# Altium project AC Circuit.PrjPcb
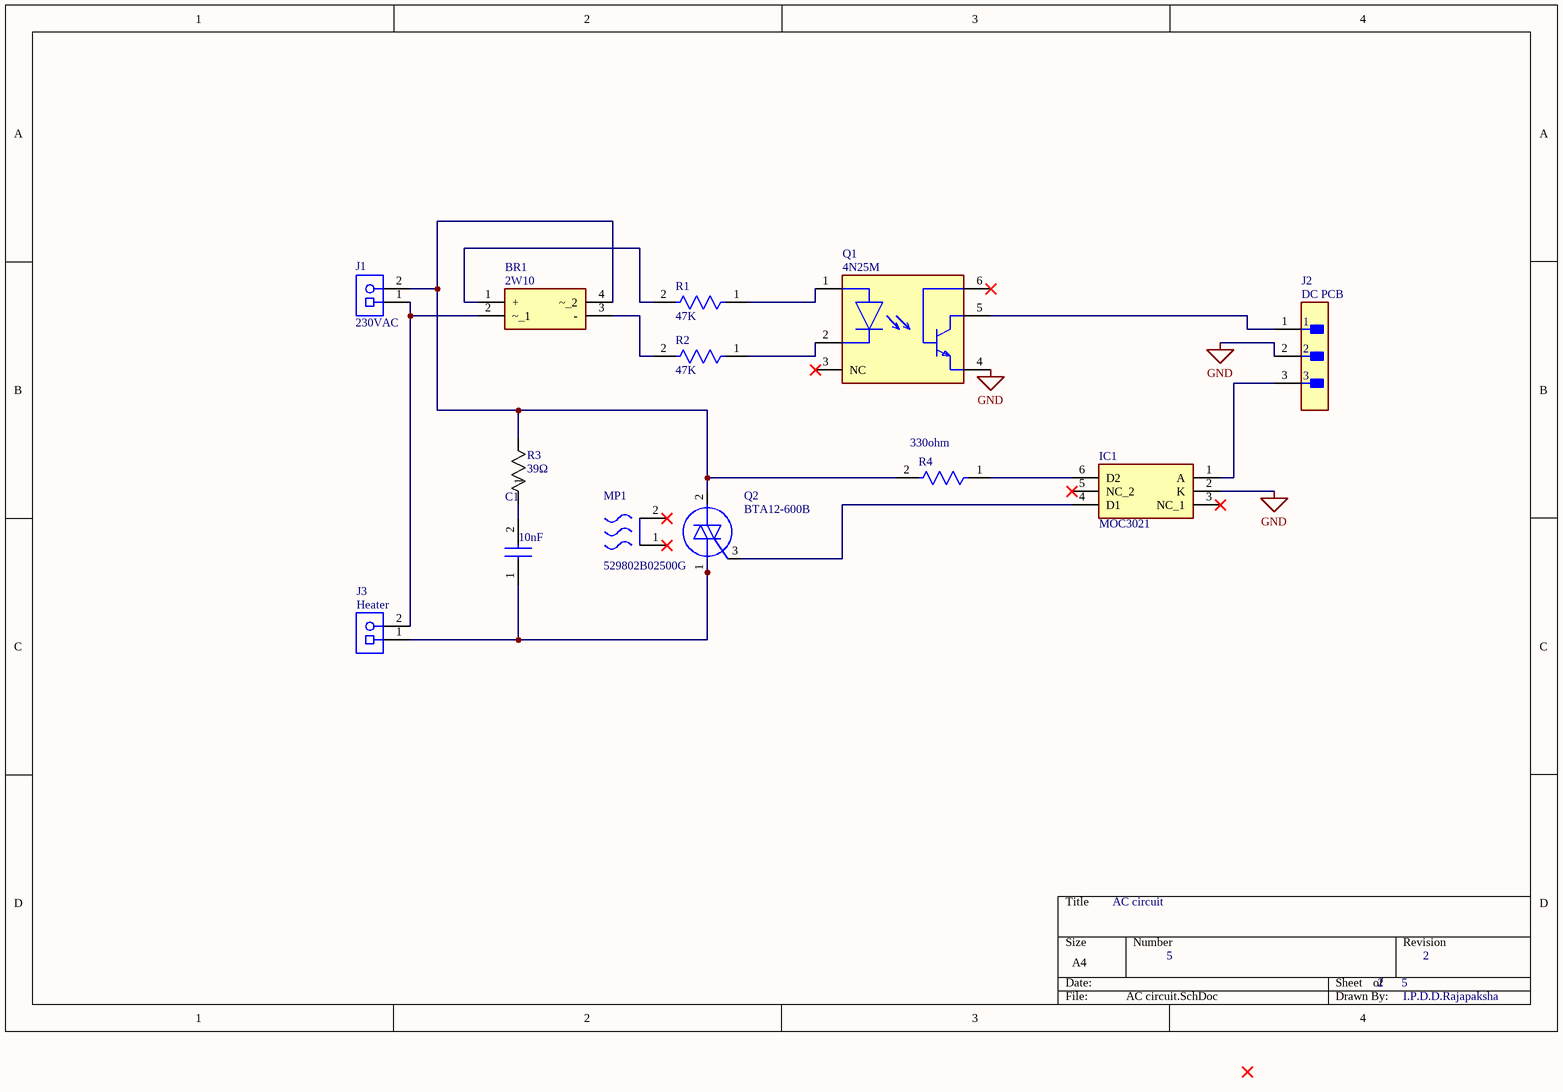
[diagram p0: AC circuit.SchDoc]
1 sheet, 13 parts. Net scope: global (net labels, ports and power ports of the same name join across sheets).
Board file: AC.PcbDoc

## Sheet AC circuit.SchDoc
size A4; SheetNumber: 1; SheetTotal: 1

### Parts
BR1  2W10  [2W10]
C1  Parameter 1: 10nF  [DE2E3SA103MA3BY02F]  (hidden comment: DE2E3SA103MA3BY02F)
IC1  MOC3021  [DIP762W50P254L712H450Q6N]
J1  Parameter 1: 230VAC  [PHOE-1729128-2_V]  (hidden comment: 1729128)
J2  Parameter 1: DC PCB  [FP-B3B-XH-AM_LF_SN-MFG]  (hidden comment: B3B-XH-AM(LF)(SN))
J3  Parameter 1: Heater  [PHOE-1729128-2_V]  (hidden comment: 1729128)
MP1  529802B02500G  [FP-529802B02500G-MFG]
Q1  4N25M  [FP-646BX-MFG]
Q2  BTA12-600B  [TO255P460X1020X1965-3P]
R1  value 47K  [FP-CMF50-0]  (hidden comment: CMF5073K200FHEB)
R2  value 47K  [FP-CMF50-0]  (hidden comment: CMF5073K200FHEB)
R3  Resistance: 39Ω  [RES_AC03_VIS]  (hidden comment: AC03000003909JAC00)
R4  value 330ohm  [FP-CMF50-0]  (hidden comment: CMF5073K200FHEB)

### Nets
GND: IC1.2(K) J2.2 Q1.4(E)
NetBR1_1: BR1.1(+) R1.2
NetBR1_2: BR1.2(~_1) J1.1 J3.2
NetBR1_3: BR1.3(-) R2.2
NetBR1_4: BR1.4(~_2) J1.2 Q2.2(MT2) R3.2 R4.2
NetC1_1: C1.1 J3.1 Q2.1(MT1)
NetC1_2: C1.2 R3.1
NetIC1_1: IC1.1(A) J2.3
NetIC1_4: IC1.4(D1) Q2.3(G)
NetIC1_6: IC1.6(D2) R4.1
NetJ2_1: J2.1 Q1.5(C)
NetQ1_1: Q1.1(A) R1.1
NetQ1_2: Q1.2(C) R2.1

Not connected (* = marked no-connect by the designer): IC1 3(NC_1)* 5(NC_2)*; MP1 1(MNT_1)* 2(MNT_2)*; Q1 3(NC)* 6(B)*

### Notes on the sheet
- AC circuit
- 5
- 2      5
- 2
- I.P.D.D.Rajapaksha

### Library data of the parts
BR1 = 2W10: Bridge Rectifier; Manufacturer_Name: Good-Ark; Datasheet Link: https://goodarksemi.com/docs/datasheets/general_purpose_bridge_rectifiers/2Wxx.pdf; Manufacturer_Part_Number: 2W10; Arrow Part Number: 2W10; Arrow Price/Stock: https://www.arrow.com/en/products/2w10/good-ark-semiconductor?region=nac
C1 = DE2E3SA103MA3BY02F: Capacitor; Manufacturer_Name: Murata Electronics; Datasheet Link: https://psearch.en.murata.com/capacitor/product/DE2E3SA103MA3BY02F.html; Height: 20mm; Manufacturer_Part_Number: DE2E3SA103MA3BY02F; Mouser Part Number: 81-DE2E3SA103MA3BY2F; Mouser Price/Stock: https://www.mouser.co.uk/ProductDetail/Murata-Electronics/DE2E3SA103MA3BY02F?qs=rrS6PyfT74eTx4TUt%2F2ksQ%3D%3D; Arrow Part Number: DE2E3SA103MA3BY02F; Arrow Price/Stock: https://www.arrow.com/en/products/de2e3sa103ma3by02f/murata-manufacturing
IC1 = MOC3021: Integrated Circuit; Manufacturer_Name: Isocom; Datasheet Link: https://www.arrow.com/en/products/moc3021/isocom; Height: 4.5mm; Manufacturer_Part_Number: MOC3021; Arrow Part Number: MOC3021; Arrow Price/Stock: https://www.arrow.com/en/products/moc3021/isocom?region=nac
J1 J3 = CMP-2000-05815-1: PCB Terminal Block, 13.5 A, 400 V, 2-Pin THD, RoHS, Bulk; Manufacturer: Phoenix Contact; Package Version: 03/2015; No. of Rows: 1; Pitch: 5.08mm; No. of Positions: 2; Voltage Rating: 400V; Current Rating: 13500mA; Manufacturer URL: http://www.phoenixcontact.com/; Datasheet URL: https://datasheet.ciiva.com/16046/1729128-16046181.pdf; RoHS: TRUE; Package URL: https://www.phoenixcontact.com/online/portal/pi/pxc/product_detail_page/!ut/p/b1/3VdJjqNKFDxLH8AFycySyWY2ozFsEPOMMQaDOX1XedGL_1Vdm5YXJleknhSKeBkvI6EA8ncAo3AYoDhBQGco6KN7VURTdemj9us_IEKEZo_YHiPAEWEFmDGOHMORkqKYCORBZxgL7ZoaZYcbFFUZ3fqxSY6GOuxydWUuHqz1ynmMFygu583Bob0Ewr6Sd_l-5m-kAueHiB0jpRwZwe58wwtkpxtMYd_LmGcDRU02dRNEyWt6Y2ti5pSyJ_reIkzIulrqApdnbT11V5jnCKbYNCvhEM1MCpPByat_X379-iThf08CI5GfOPqfBeS3BRoBOdD55AKVv0iLwCMq-2BrzXWSGRH7pUGD9uwXQjiph3xL0DKQwdGa0JImiIOmBNOestqgwTHSSs2oOep-78apyXQBvNi8ZLaFjvjWvcaUEBu0MC6Wbe-d6mB0FAebo2lUWinqYaZs5DAYzV0RP9yitUjnGJ0iI9xhZkT42OCQNUJJhkgWINNQLP2JFP6OpMg3JCVg70jqHT0lvKOnhHf0lPuOnnLf0VPuWx6_dxwUIvwk5WMkT0kLL1mh61l2yZVSzG3pYV_bqo-mj6uMKwKwdnnW8Jh5RTOJzMOA5c-eJDaZQw4mTMPH02PvS_ZAqNVjVTo2WyYLkwH_KU1mmmG5kjRhDqPXLwwVHvVOjCM60-fpXvTDfMGW1PVFVS1r4e4yVDk4ZdNbkUHvqPqQSeian4UD39fNKmachqdJ1NJbyk8rXT9mXTvPk3oE5meulKGgiruPJek-4I9hTT6G8ZLOyRSm2RRVbThERQad5OS28hdt4YW4vG0stgYYzsWsK4_7y6DZMjJSCqri1kyiZR5vD7pwIrNR7QwPHTcLTI5qT7eRlpHrdGiupYlqQDJ7zy_CND8fWWBoLRXxk1RVcXiBQwbTD4Xi7KL-FuO94t9xaqweXzH; PartNumber: 1729128; Package Description: 2-Pin Through Hole Device, Body 8.1 x 10.16 mm, Pitch 5.08 mm; Datasheet Version: 12/2013; Mounting Technology: ThroughHole; Orientation: Horizontal; Package Reference: 1729128-2; Packing: Bulk
J2 = CMP-17438-000009-1: CONN HEADER VERT 3POS 2.5MM; Max Current Rating: 3A; Gender: Male; Max Voltage Rating (AC): 250V; Connector Type: Male Pin; Pitch: 0.098inch; Number of Positions: 3; Contact Resistance: 20mR; Termination: Press-Fit; Housing Color: White; Housing Material: Polyamide; Orientation: Straight; Contact Material: Brass; Contact Type: Male Pin; Color: Natural; Packaging: Bulk; Lead Free: Lead Free; Depth: 5.75mm; Number of Rows: 1; Contact Plating: Tin; Length: 9.9mm; Max Operating Temperature: 85°C; Series: XH; Min Operating Temperature: -25°C; Fastening Type: Detent; Mount: Through Hole
MP1 = CMP-69313-000009-1: HEATSINK TO-220 W/PINS 1.5"TALL; Finish: Anodized; Shape: Fins; Thermal Resistance @ Forced Air Flow (100 LFM): 3°C/W; Natural Thermal Resistance: 3.7°C/W; Depth: 25.4mm; Height Off Base: 1.5inch; Length: 41.91mm; Radiation Hardening: No; Type: Passive; RoHS Compliant: Yes; Case/Package: Radial; Mount: Bolt; REACH SVHC: No SVHC; Width: 1.65inch; Package Quantity: 500; Packaging: Bulk; Series: 5298; Lead Free: Lead Free; Package Cooled: TO-220; Height: 38.1mm; Material: Aluminium; Color: Black
Q1 = CMP-00278-84323282-1: 4N25M Optocoupler DC-IN 1-CH Transistor With Base DC-OUT 6-Pin PDIP Tube - Bulk; Manufacturer Lifecycle Status: ACTIVE; Isolation Voltage: 7.5kV; Number of Circuits: 1; Collector Emitter Voltage (VCEO): 500mV; Max Junction Temperature (Tj): 125°C; Collector Emitter Breakdown Voltage: 30V; Forward Current: 10mA; Max Input Current: 50mA; Turn-Off Delay Time: 2µs; Current Transfer Ratio: 20%; Reverse Voltage: 6V; Power Dissipation: 250mW; Max Power Dissipation: 200mW; Approvals: UL; Forward Voltage: 1.18V; Max Operating Temperature: 100°C; Min Operating Temperature: -55°C; RoHS: Compliant; Lifecycle Status: Production; NexarPartId: 84323282; Weight: 855mg; Reverse Breakdown Voltage: 6V; Rise Time: 2µs; Case/Package: DIP; Max Output Voltage: 30V; Number of Elements: 1; Output Voltage: 30V; Mount: Through Hole; REACH SVHC: No SVHC; Length: 7.12mm; Input Current: 10mA; Collector Emitter Saturation Voltage: 500mV; Width: 6.5mm; Schedule B: 8541408000, 8541408000; Height: 5.08mm; Turn-On Delay Time: 2µs; Number of Pins: 6; Fall Time: 2µs; Radiation Hardening: No; Lead Free: Lead Free; Number of Channels: 1
Q2 = BTA12-600B: Triac; Manufacturer_Name: STMicroelectronics; Datasheet Link: http://uk.rs-online.com/web/p/products/2512965; Height: 4.6mm; Manufacturer_Part_Number: BTA12-600B; Mouser Part Number: N/A; Mouser Price/Stock: https://www.mouser.co.uk/ProductDetail/STMicroelectronics/BTA12-600B?qs=gB4SHlWTQ%2FvH29WXA0SrJA%3D%3D
R1 R2 = CMP-00030-44386654-1: CMF5073K200FHEB Res Metal Film 73.2K Ohm 1% 0.125W(1/8W) ±50ppm/°C Epoxy AXL T/R; Max Power Dissipation: 250mW; Voltage Rating: 200V; Power Rating: 125mW; Resistance: 73.2kΩ; Tolerance: 1%; Width: 1.65mm; Length: 3.81mm; Schedule B: 8533210090, 8533210090; Termination: Axial; Lead Free: Lead Free; Diameter: 1.65mm; Voltage Rating (DC): 200V; NexarPartId: 44386654; Packaging: Cut Tape; Max Operating Temperature: 175°C; Composition: Metal Film; RoHS: Compliant; Mount: Through Hole; Features: Flame Retardant Coating, Moisture Resistant; Number of Terminations: 2; Temperature Coefficient: 50ppm/°C; Min Operating Temperature: -55°C; Case/Package: Axial
R3 = CMP-00030-42521922-1: AC03000003909JAC00 AC03 Series Axial Wirewound Resistor 39Ohms +/-5% 3W -80 - -10ppm/degC; Temperature Coefficient: -10ppm/°C; Tolerance: 5%; Lead Diameter: 800µm; Voltage Rating (DC): 11V; Composition: Wirewound; Termination: Axial; Power Rating: 3W; Number of Pins: 2; Length: 13mm; REACH SVHC: Unknown; Schedule B: 8533210080, 8533210080; Min Operating Temperature: -40°C; Case/Package: Axial; Weight: 749.986634mg; Contact Plating: Tin; Diameter: 4.8mm; Radiation Hardening: No; Max Operating Temperature: 275°C; Features: Flame Retardant Coating; Military Standard: Not; Max Power Dissipation: 3W; NexarPartId: 42521922; RoHS: Compliant; Width: 4.8mm; Packaging: Cut Tape (CT); Number of Terminations: 2; Parameter 1: *
R4 = CMP-00030-44386654-1: CMF5073K200FHEB Res Metal Film 73.2K Ohm 1% 0.125W(1/8W) ±50ppm/°C Epoxy AXL T/R; Max Power Dissipation: 250mW; Voltage Rating: 200V; Power Rating: 125mW; Tolerance: 1%; Width: 1.65mm; Length: 3.81mm; Schedule B: 8533210090, 8533210090; Termination: Axial; Lead Free: Lead Free; Diameter: 1.65mm; Voltage Rating (DC): 200V; NexarPartId: 44386654; Packaging: Cut Tape; Max Operating Temperature: 175°C; Composition: Metal Film; RoHS: Compliant; Mount: Through Hole; Features: Flame Retardant Coating, Moisture Resistant; Number of Terminations: 2; Temperature Coefficient: 50ppm/°C; Min Operating Temperature: -55°C; Case/Package: Axial; Resistance: 330ohm